# Altium schematic sheet GaN_LLC.SchDoc
size A; SheetNumber: 1; SheetTotal: 1
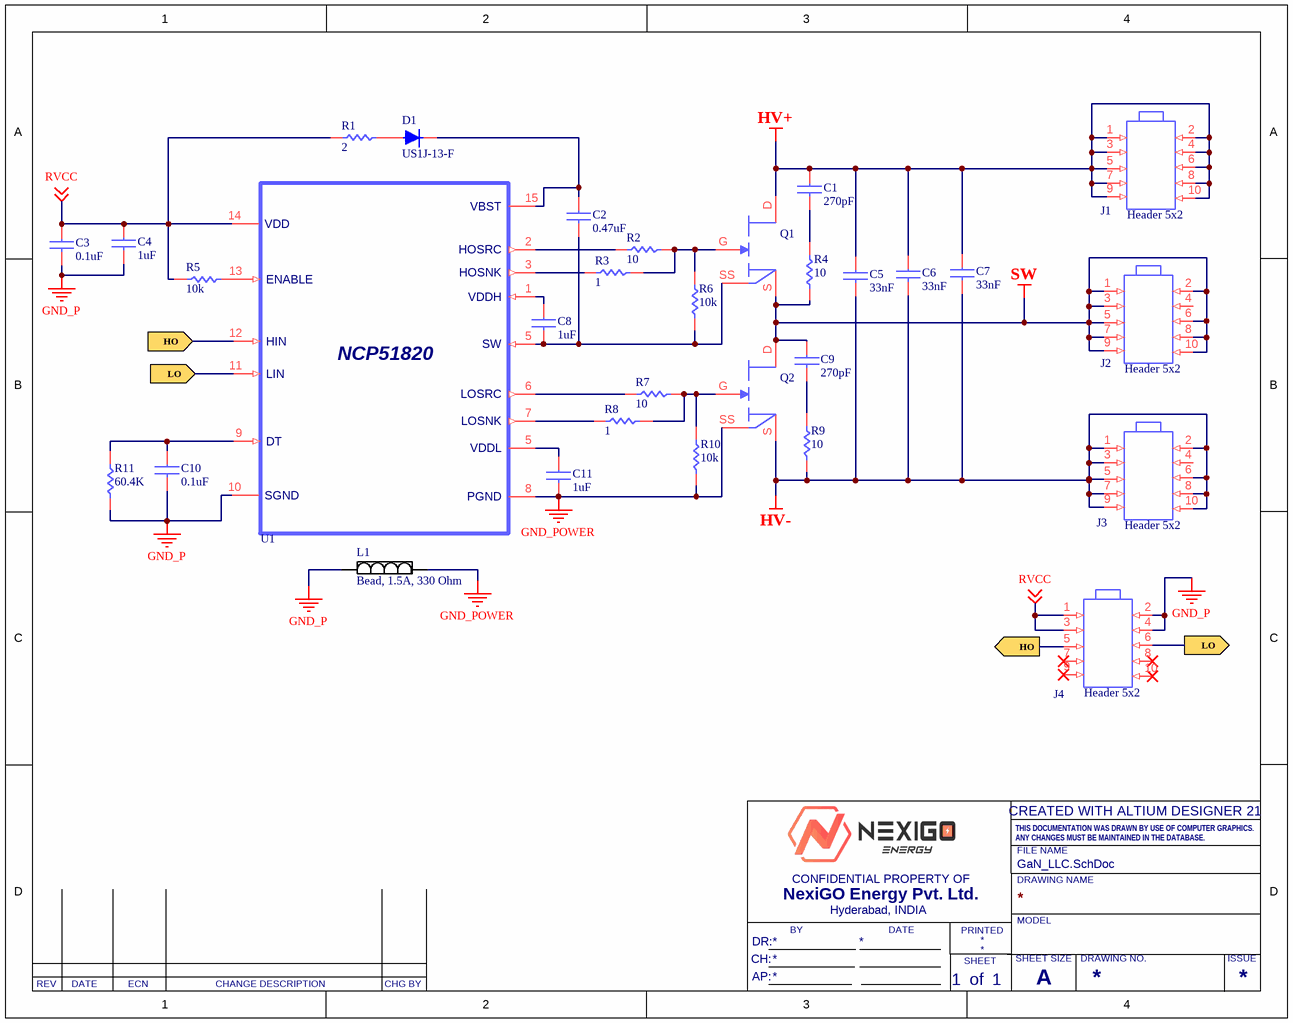
[diagram p0: GaN_LLC.SchDoc]

## Parts
C1  value 270pF  [1206]  (hidden comment: CAP_CERAMIC)
C2  value 0.47uF  [Cap, 0603]  (hidden comment: CAP_CERAMIC)
C3  value 0.1uF  [Cap, 0603]  (hidden comment: CAP_CERAMIC)
C4  value 1uF  [Cap, 0603]  (hidden comment: CAP_CERAMIC)
C5  value 33nF  [1210]  (hidden comment: CAP_CERAMIC)
C6  value 33nF  [1210]  (hidden comment: CAP_CERAMIC)
C7  value 33nF  [1210]  (hidden comment: CAP_CERAMIC)
C8  value 1uF  [Cap, 0603]  (hidden comment: CAP_CERAMIC)
C9  value 270pF  [1206]  (hidden comment: CAP_CERAMIC)
C10  value 0.1uF  [Cap, 0603]  (hidden comment: CAP_CERAMIC)
C11  value 1uF  [Cap, 0603]  (hidden comment: CAP_CERAMIC)
D1  value US1J-13-F  [SMA]  (hidden comment: Diode)
J1  value Header 5x2  [HDR2X5_SMD]  (hidden comment: Header 5x2, 100Mils)
J2  value Header 5x2  [HDR2X5_SMD]  (hidden comment: Header 5x2, 100Mils)
J3  value Header 5x2  [HDR2X5_SMD]  (hidden comment: Header 5x2, 100Mils)
J4  value Header 5x2  [HDR2X5_SMD]  (hidden comment: Header 5x2, 100Mils)
L1  value Bead, 1.5A, 330 Ohm  [0603]  (hidden comment: Bead, 6A, 33 Ohm)
Q1  GS66508B  [GS66508B]  (value not drawn)
Q2  GS66508B  [GS66508B]  (value not drawn)
R1  value 2  [Res, 0603]  (hidden comment: Res)
R2  value 10  [Res, 0603]  (hidden comment: Res)
R3  value 1  [Res, 0603]  (hidden comment: Res)
R4  value 10  [Res_2512]  (hidden comment: Res)
R5  value 10k  [Res, 0603]  (hidden comment: Res)
R6  value 10k  [Res, 0603]  (hidden comment: Res)
R7  value 10  [Res, 0603]  (hidden comment: Res)
R8  value 1  [Res, 0603]  (hidden comment: Res)
R9  value 10  [Res_2512]  (hidden comment: Res)
R10  value 10k  [Res, 0603]  (hidden comment: Res)
R11  value 60.4K  [Res, 0603]  (hidden comment: Res)
U1  NCP51820  [QFN_0AMNTWG_ONS]  (value not drawn)

## Ports
HO (in), HO (out), LO (in), LO (out)

## Nets
GND_P: C3.2 C4.2 C10.2 J4.2 J4.4 L1.1 R11.1 U1.10(SGND)
GND_POWER: C11.2 L1.2 Q2.SS R10.1 U1.8(PGND)
HV+: C1.1 C5.1 C6.1 C7.1 J1.1 J1.2 J1.3 J1.4 J1.5 J1.6 J1.7 J1.8 J1.9 J1.10 Q1.D
HV-: C5.2 C6.2 C7.2 J3.1 J3.2 J3.3 J3.5 J3.6 J3.7 J3.8 J3.9 J3.10 Q2.S R9.1
SW: C9.1 J2.1 J2.2 J2.3 J2.5 J2.6 J2.7 J2.8 J2.9 J2.10 Q1.S Q2.D R4.1
HO: J4.5 U1.12(HIN) ; port HO
LO: J4.6 U1.11(LIN) ; port LO
RVCC: C3.1 C4.1 J4.1 J4.3 R1.1 R5.2 U1.14(VDD) ; off-sheet RVCC
NetC1_2: C1.2 R4.2
NetC2_1: C2.1 D1.1 U1.15(VBST)
NetC2_2: C2.2 C8.2 Q1.SS R6.1 U1.5(SW)
NetC8_1: C8.1 U1.1(VDDH)
NetC9_2: C9.2 R9.2
NetC10_1: C10.1 R11.2 U1.9(DT)
NetC11_1: C11.1 U1.5(VDDL)
NetD1_2: D1.2 R1.2
NetQ1_G: Q1.G R2.2 R3.2 R6.2
NetQ2_G: Q2.G R7.2 R8.2 R10.2
NetR2_1: R2.1 U1.2(HOSRC)
NetR3_1: R3.1 U1.3(HOSNK)
NetR5_1: R5.1 U1.13(ENABLE)
NetR7_1: R7.1 U1.6(LOSRC)
NetR8_1: R8.1 U1.7(LOSNK)

Not connected (* = marked no-connect by the designer): J2 4; J3 4; J4 7* 8* 9* 10*

## Notes on the sheet
- THIS DOCUMENTATION WAS DRAWN BY USE OF COMPUTER GRAPHICS.   ANY CHANGES MUST BE MAINTAINED IN THE DATABASE.
- CREATED WITH ALTIUM DESIGNER 21
- Hyderabad, INDIA
- CONFIDENTIAL PROPERTY OF
- NexiGO Energy Pvt. Ltd.
- DRAWING NAME
- FILE NAME
- REV
- DATE
- ECN
- CHANGE DESCRIPTION
- CHG BY
- CH:
- DR:
- BY
- SHEET
- of
- PRINTED
- SHEET SIZE
- MODEL
- A
- DRAWING NO.
- ISSUE
- AP:

## Library data of the parts
C1 C9 = 10-001-00185: CAP CER 270PF 1KV C0G/NP0 1206; Manufacturer P/N: CL31C271JIHNNNE; Manufacturer: Samsung Electro-Mechanics; Max Voltage: 1000V; Tolerance: ±5%; Invacare P/N: 10-001-00185; Component Kind: Capacitor; Component Type: Ceramic; Datasheet: https://www.samsungsem.com/kr/support/product-search/mlcc/CL31C271JIHNNNE.jsp; Package: 1206; Pin Count: 2
C2 = 1187597: CAP CER 0.47UF 25V 10% X7R 0603; Manufacturer P/N: 06033C474KAT2A; Manufacturer: AVX Corporation; Invacare P/N: 1187597; Component Kind: Capacitor; Component Type: Ceramic; Datasheet: http://psearch.murata.com/capacitor/product/GCM188R71E474KA64%23.pdf; Max Voltage: 25V; Package: 0603; Pin Count: 2; Tolerance: 10%; Status: Distrubuted
C3 C10 = 1187810: CAP CER 0.1UF 50V 10% X7R 0603; Manufacturer P/N: UMK107B7104KA-T; Manufacturer: TAIYO YUDEN; Invacare P/N: 1187810; Component Kind: Capacitor; Component Type: Ceramic; Datasheet: http://www.yuden.co.jp/productdata/catalog/en/mlcc_all_e.pdf; Max Voltage: 50V; Package: 0603; Pin Count: 2; Tolerance: 10%; Status: Distrubuted
C4 C8 C11 = 1187808: CAP CER 1UF 25V 10% X7R 0603; Manufacturer P/N: CL10B105KA8NNNC; Manufacturer: Samsung Electro-Mechanics; Invacare P/N: 1187808; Component Kind: Capacitor; Component Type: Ceramic; Datasheet: http://www.digikey.com/product-detail/en/CL10B105KA8NNNC/1276-1184-6-ND/3891698; Max Voltage: 25V; Package: 0603; Pin Count: 2; Tolerance: 10%; Status: Distrubuted
C5-C7 = 10-001-00187: CAP CER 0.033UF 1.5KV X7R 1210; Manufacturer P/N: C1210C333KFRAC7800; Manufacturer: KEMET; Max Voltage: 1500V; Tolerance: 10%; Invacare P/N: 10-001-00187; Component Kind: Capacitor; Component Type: Ceramic; Datasheet: https://content.kemet.com/datasheets/KEM_C1010_X7R_HV_SMD.pdf; Package: 1210; Pin Count: 2
D1 = 10-001-00132: DIODE GEN PURP 600V 1A SMA; Manufacturer: Diodes Incorporated; Invacare P/N: 10-001-00132; Component Kind: Diode; Component Type: General; Datasheet: https://www.diodes.com/assets/Datasheets/ds16008.pdf; Manufacturer P/N: US1J-13-F; Max Current: 1A; Max Voltage: 600V; Pin Count: 2
J1-J4 = 10-001-00188: HEADER 5X2 2MM Pitch SMT; Manufacturer: Sullins Connector Solutions; Manufacturer P/N: NRPN052MAMS-RC; NexiGO P/N: 10-001-00188; Component Kind: Power; Component Type: Header; Datasheet: https://drawings-pdf.s3.amazonaws.com/10495.pdf; Pin Count: 10
L1 = 1187686: FERRITE BEAD 330 OHM 1.5A 0603; Manufacturer: Murata; Manufacturer P/N: BLM18SG331TN1; Invacare P/N: 1187686; Component Kind: Inductor; Component Type: Ferrite Bead; Datasheet: http://www.murata.com/products/catalog/pdf/c31e.pdf#BLM18P; Pin Count: 2; Status: Distributed
Q1 Q2 = 10-001-00184: GS66508B GaN FET 650V 30A 50mOhm SMT; Manufacturer: GaN Systems; Manufacturer P/N: GS66508B-MR; Invacare P/N: 10-001-00184; Component Kind: Transistor; Component Type: GAN; Datasheet: https://gansystems.com/wp-content/uploads/2020/04/GS66508B-DS-Rev-200402.pdf; Pin Count: 4; Value: GS66508B; Package: GS66508B
R1 = 1187737: RES 2 OHM 1/10W 1% 0603 SMD; Manufacturer: Vishay / Dale; Manufacturer P/N: CRCW06032R00FNEA; Temp Coefficient: ±100ppm/°C; Invacare P/N: 1187737; Component Kind: Standard; Component Type: Standard; Datasheet: http://www.vishay.com/docs/20035/dcrcwe3.pdf; Height: 0.55mm; Package Size: 0603; Pin Count: 2; Tolerance: ±1%; Cost: 0.003
R2 R7 = 1187726: Res, 10, 1%, 0603,1/10W, Panasonic, 100ppm; Manufacturer P/N: ERJ-3EKF10R0V; Temp Coefficient: ±100ppm/°C; Invacare P/N: 1187726; Component Kind: Standard; Component Type: Standard; Datasheet: http://search.digikey.com/us/en/products/ERJ-3EKF10R0V/P10.0HTR-ND/196065; Height: 0.55mm; Manufacturer: Panasonic; Package Size: 0603; Pin Count: 2; Tolerance: ±1%; Cost: 0.0023; Status: Distrubuted
R3 R8 = 1187757: RES 1 OHM 1/10W 0603; Manufacturer: Vishay/Dale; Manufacturer P/N: CRCW06031R00FKEA; Temp Coefficient: ±100ppm/°C; Tolerance: ±1%; Invacare P/N: 1187757; Component Kind: Standard; Component Type: Standard; Datasheet: http://www.vishay.com/docs/20035/dcrcwe3.pdf; Height: 0.55mm; Package Size: 0603; Pin Count: 2; Status: Distrubuted
R4 R9 = 10-001-00186: RES 10 OHM 5% 2W 2512; Manufacturer: YAGEO; Manufacturer P/N: SR2512JK-7W10RL; Temp Coefficient: ±200ppm/°C; Invacare P/N: 10-001-00186; Component Kind: Standard; Component Type: Standard; Datasheet: https://www.yageo.com/upload/media/product/productsearch/datasheet/rchip/PYu-SR_20105_RoHS_L_9.pdf; Height: 0.5MM; Package Size: 2512; Pin Count: 2; Tolerance: 5%
R5 R6 R10 = 1136869: Res, 10K, 1%, 0603,1/10W, Panasonic, 100ppm; Manufacturer P/N: ERJ-3EKF1002V; Temp Coefficient: ±100ppm/°C; Invacare P/N: 1136869; Component Kind: Standard; Component Type: Standard; Datasheet: http://search.digikey.com/us/en/products/ERJ-3EKF1001V/P1.00KHTR-ND/196032; Height: 0.55mm; Manufacturer: Panasonic; Package Size: 0603; Pin Count: 2; Tolerance: ±1%; Cost: 0.0023; Status: Distrubuted
R11 = 1187604: RES 60.4K OHM 1/10W 1% 0603 SMD; Manufacturer: Panasonic; Manufacturer P/N: ERJ-3EKF6042V; Invacare P/N: 1187604; Component Kind: Standard; Component Type: Standard; Datasheet: http://download.siliconexpert.com/pdfs/2012/12/14/4/39/25/825/pns_/manual/aoa0000ce2.pdf#http://download.siliconexpert.com/pdfs/2012/12/14/4/39/25/825/pns_/manual/aoa0000ce2.pdf; Height: 0.55mm; Package Size: 0603; Pin Count: 2; Temp Coefficient: ERJ-3EKF6042V; Tolerance: ±1%; Cost: 0.0023; Status: Distrubuted
U1 = 10-001-00189: NCP51820 FULL BRIDGE GATE DRIVE 15QFN SMD; Manufacturer: Onsemi; Manufacturer P/N: NCP51820AMNTWG; Invacare P/N: 10-001-00189; Value: NCP51820; Component Kind: Gate Drive; Component Type: Full Bridge; Pin Count: 15; Datasheet: https://www.onsemi.com/pdf/datasheet/ncp51820-d.pdf